# Altium schematic sheet top_level.SchDoc: Fault-Tolerant Quadcopter
size A; DrawnBy: Vaughn Kottler; Engineer: Vaughn Kottler; Revision: A
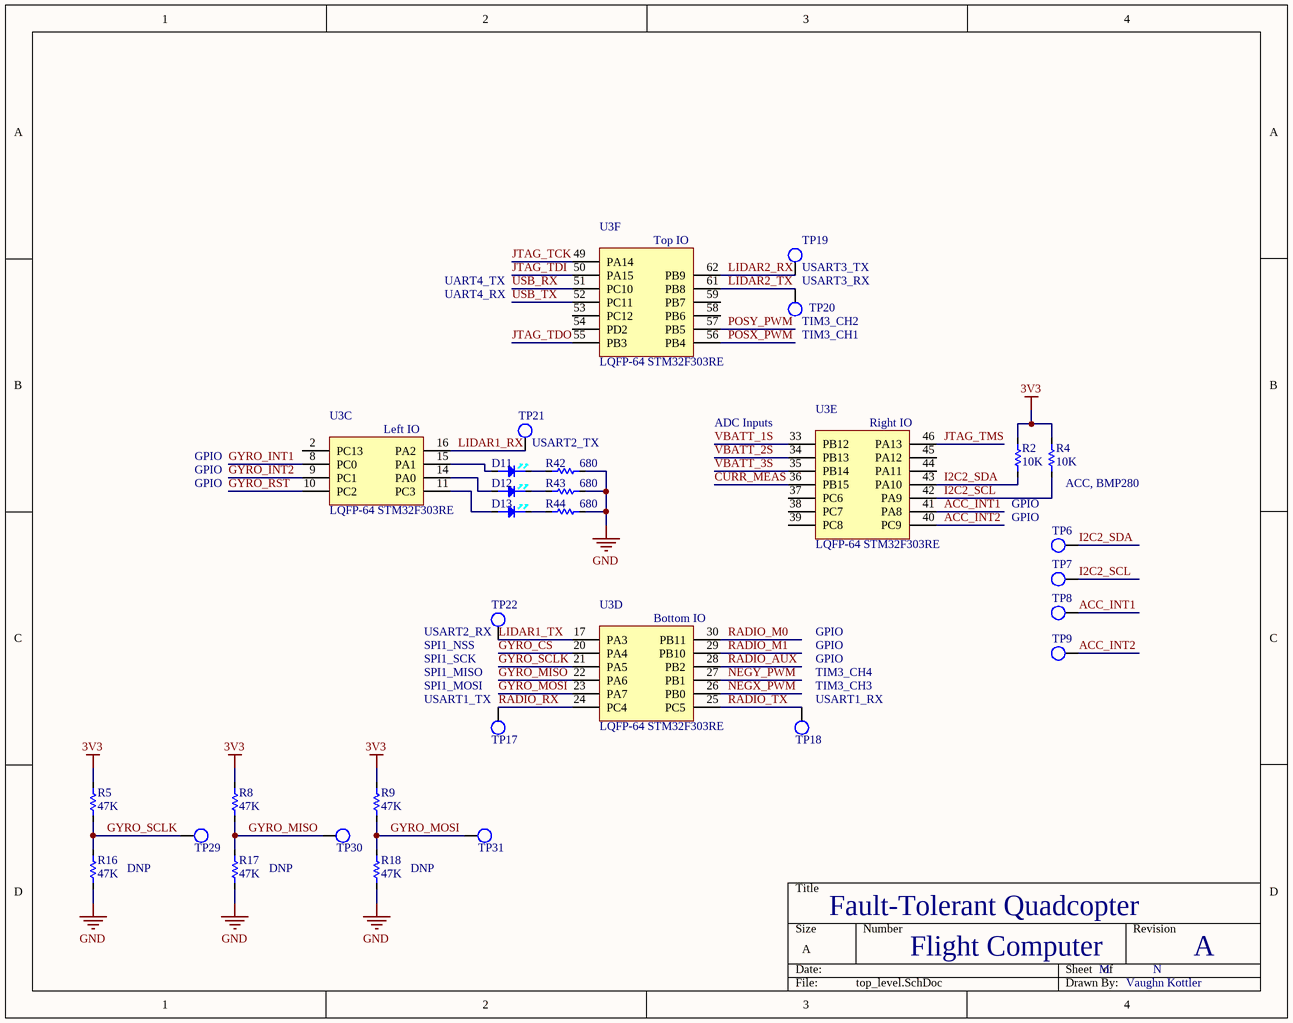
[diagram p0: top_level.SchDoc]

## Parts
D11  LED-WHT-20mA  [LED-0805]  (value not drawn)
D12  LED-WHT-20mA  [LED-0805]  (value not drawn)
D13  LED-WHT-20mA  [LED-0805]  (value not drawn)
R2  10K  [RES-0805]
R4  10K  [RES-0805]
R5  47K  [RES-0805]
R8  47K  [RES-0805]
R9  47K  [RES-0805]
R16  47K  [RES-0805]
R17  47K  [RES-0805]
R18  47K  [RES-0805]
R42  680  [RES-0805]
R43  680  [RES-0805]
R44  680  [RES-0805]
TP6  Test Point  [0603 Test Point]  (value not drawn)
TP7  Test Point  [0603 Test Point]  (value not drawn)
TP8  Test Point  [0603 Test Point]  (value not drawn)
TP9  Test Point  [0603 Test Point]  (value not drawn)
TP17  Test Point  [0603 Test Point]  (value not drawn)
TP18  Test Point  [0603 Test Point]  (value not drawn)
TP19  Test Point  [0603 Test Point]  (value not drawn)
TP20  Test Point  [0603 Test Point]  (value not drawn)
TP21  Test Point  [0603 Test Point]  (value not drawn)
TP22  Test Point  [0603 Test Point]  (value not drawn)
TP29  Test Point  [0603 Test Point]  (value not drawn)
TP30  Test Point  [0603 Test Point]  (value not drawn)
TP31  Test Point  [0603 Test Point]  (value not drawn)
U3  LQFP-64 STM32F303RE  [LQFP64]  (parts C,D,E,F of 6)

## Nets
3V3: R2.2 R4.2 R5.2 R8.2 R9.2
GND: R16.1 R17.1 R18.1 R42.2 R43.2 R44.2
ACC_INT1: TP8.1 U3.41(PA8)
ACC_INT2: TP9.1 U3.40(PC9)
CURR_MEAS: U3.36(PB15)
GYRO_CS: U3.20(PA4)
GYRO_INT1: U3.8(PC0)
GYRO_INT2: U3.9(PC1)
GYRO_MISO: R8.1 R17.2 TP30.1 U3.22(PA6)
GYRO_MOSI: R9.1 R18.2 TP31.1 U3.23(PA7)
GYRO_RST: U3.10(PC2)
GYRO_SCLK: R5.1 R16.2 TP29.1 U3.21(PA5)
I2C2_SCL: R4.1 TP7.1 U3.42(PA9)
I2C2_SDA: R2.1 TP6.1 U3.43(PA10)
JTAG_TCK: U3.49(PA14)
JTAG_TDI: U3.50(PA15)
JTAG_TDO: U3.55(PB3)
JTAG_TMS: U3.46(PA13)
LIDAR1_RX: TP21.1 U3.16(PA2)
LIDAR1_TX: TP22.1 U3.17(PA3)
LIDAR2_RX: TP19.1 U3.62(PB9)
LIDAR2_TX: TP20.1 U3.61(PB8)
NEGX_PWM: U3.26(PB0)
NEGY_PWM: U3.27(PB1)
POSX_PWM: U3.56(PB4)
POSY_PWM: U3.57(PB5)
RADIO_AUX: U3.28(PB2)
RADIO_M0: U3.30(PB11)
RADIO_M1: U3.29(PB10)
RADIO_RX: TP17.1 U3.24(PC4)
RADIO_TX: TP18.1 U3.25(PC5)
USB_RX: U3.51(PC10)
USB_TX: U3.52(PC11)
VBATT_1S: U3.33(PB12)
VBATT_2S: U3.34(PB13)
VBATT_3S: U3.35(PB14)
NetD11_1: D11.1(CT) U3.15(PA1)
NetD11_2: D11.2(AN) R42.1
NetD12_1: D12.1(CT) U3.14(PA0)
NetD12_2: D12.2(AN) R43.1
NetD13_1: D13.1(CT) U3.11(PC3)
NetD13_2: D13.2(AN) R44.1

Not connected (* = marked no-connect by the designer): U3 2(PC13) 37(PC6) 38(PC7) 39(PC8) 44(PA11) 45(PA12) 53(PC12) 54(PD2) 58(PB6) 59(PB7)

## Notes on the sheet
- UART4_TX
- UART4_RX
- USART3_RX
- (near TP19) USART3_TX
- (near TP20) TIM3_CH1
- (near TP20) TIM3_CH2
- (near U3) ADC Inputs
- GPIO
- (near TP21) USART2_TX
- (near R4) ACC, BMP280
- (near TP22) USART2_RX
- (near TP17) USART1_TX
- (near TP22) SPI1_NSS
- SPI1_SCK
- SPI1_MISO
- (near TP17) SPI1_MOSI
- (near TP18) USART1_RX
- (near TP18) TIM3_CH3
- (near TP18) TIM3_CH4
- (near R16) DNP
- (near R17) DNP
- (near R18) DNP
- Flight Computer
- M
- N
- (in symbol STM32F303RET6, part C) Left IO
- (in symbol STM32F303RET6, part D) Bottom IO
- (in symbol STM32F303RET6, part E) Right IO
- (in symbol STM32F303RET6, part F) Top IO

## Library data of the parts
D11-D13 = LED-WHT-20mA: 2.2V, 0805; ComponentLink1Description: Resistor Book (Amazon); ComponentLink1URL: https://www.amazon.com/gp/product/B071J21FYF/; Supplier 1: Digi-Key; Supplier Part Number 1: 475-1410-1-ND
R2 R4 = RES-10K-1/8W: 0805; ComponentLink1Description: Resistor Book (Amazon); ComponentLink1URL: https://www.amazon.com/gp/product/B071J21FYF/
R5 R8 R9 R16-R18 = RES-47K-1/8W: 0805; ComponentLink1Description: Resistor Book (Amazon); ComponentLink1URL: https://www.amazon.com/gp/product/B071J21FYF/
R42-R44 = RES-680-1/8W: 0805; ComponentLink1Description: Resistor Book (Amazon); ComponentLink1URL: https://www.amazon.com/gp/product/B071J21FYF/
TP6-TP9 TP17-TP22 TP29-TP31 = Test Point: 0603; Supplier 1: Digi-Key; Supplier Part Number 1: A106145DKR-ND
U3 = STM32F303RET6: ARM Cortex-M4 32-bit MCU+FPU; Supplier 1: Digi-Key; ComponentLink1Description: NUCLEO-F303RE; ComponentLink1URL: https://www.st.com/content/st_com/en/products/evaluation-tools/product-evaluation-tools/mcu-eval-tools/stm32-mcu-eval-tools/stm32-mcu-nucleo/nucleo-f303re.html; ComponentLink2Description: MBED; ComponentLink2URL: https://os.mbed.com/platforms/ST-Nucleo-F303RE/; ComponentLink3Description: Datasheet; ComponentLink3URL: https://www.st.com/content/ccc/resource/technical/document/datasheet/2c/6f/d7/64/1f/a3/4f/c9/DM00118585.pdf/files/DM00118585.pdf/jcr:content/translations/en.DM00118585.pdf; Supplier Part Number 1: 497-15163-ND; ComponentLink4Description: Reference Manual; ComponentLink4URL: https://www.st.com/content/ccc/resource/technical/document/reference_manual/4a/19/6e/18/9d/92/43/32/DM00043574.pdf/files/DM00043574.pdf/jcr:content/translations/en.DM00043574.pdf